# EasyEDA Pro project ProPrj_HEMY 2.0_2025-04-23.epro, schematic Schematic3_1
Board Name: DC & ETH_1; Create Date: 2025-03-09; Page Name: P1; Project Name: AstraNode; Schematic Name: Schematic3_1; Update Date: 2025-03-09; Company: EasyEDA.com; Page Size: A4; Version: V1.0
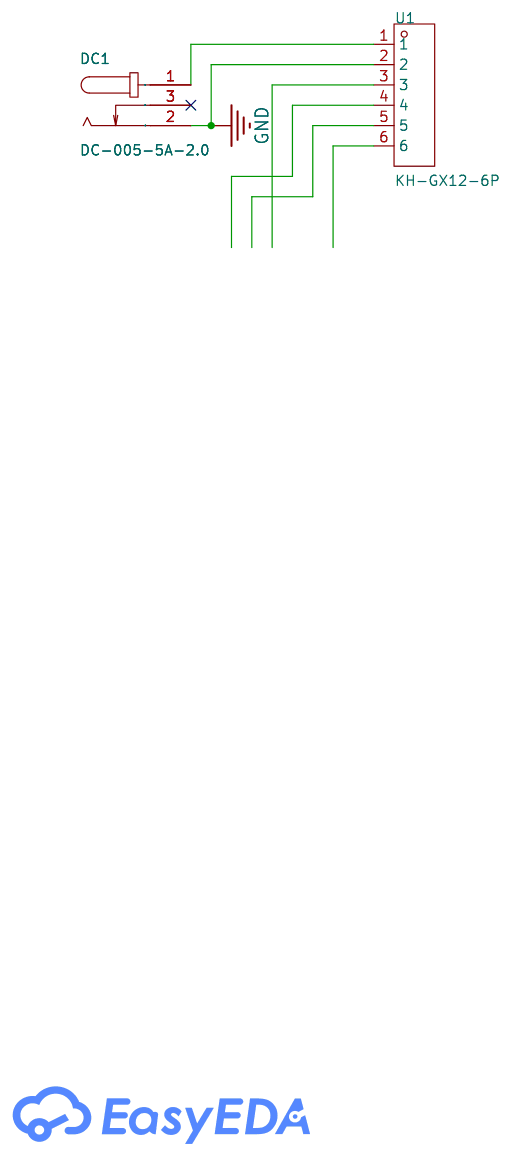
[diagram p5: schematic sheet]

## Parts
DC1  DC-005-5A-2.0  [DC-IN-TH_DC-005-5A-2.0]  (no BOM)
U1  KH-GX12-6P  [CONN-TH_GX12-6P]  (no BOM)

## Library data of the parts
DC1 = DC-005-5A-2.0: Connector Type:DC Power Receptacle Mounting Style:Bend insert Inside Contact Diameter:2mm Outside Contact Diameter:6.2mm Current Rating (Max):5A Voltage Rating (Max):24V Operating Temperature Range:-20℃~+70℃ Operating Temperature Range:-20℃~+70℃; LCSC Part Name: DC电源插座 内径:2mm 外径:6.2mm; Supplier Part: C381116; Manufacturer: XKB Connection(中国星坤); Supplier Footprint: 插件; JLCPCB Part Class: Extended Part; Datasheet: https://atta.szlcsc.com/upload/public/pdf/source/20211015/707A35F7AB6E89C57AAB641950105BB7.pdf; Supplier: LCSC; Connector Type: DC Power Receptacle; Mounting Style: Bend insert; Inside Contact Diameter: 2mm; Outside Contact Diameter: 6.2mm; Current Rating (Max): 5A; Voltage Rating (Max): 24V; Operating Temperature Range: -20℃~+70℃
U1 = KH-GX12-6P: Socket Specification:M12 Number of Pins:6P Gender:公母一套 Angle:直头 Coding Scheme:- Level of Protection:- Current Rating (Max):5A Rated Voltage (Max):125V Contact Material:- Contact Plating:- Operating Temperature Range:-20℃~+85℃ Operating Temperature Range:-; LCSC Part Name: 2件套; Supplier Part: C18203264; Manufacturer: kinghelm(金航标); JLCPCB Part Class: Extended Part; Datasheet: https://atta.szlcsc.com/upload/public/pdf/source/20230927/54C8C016C9BD795CB5C7B9261DE17A1E.pdf; Supplier: LCSC; Socket Specification: M12; Number of Pins: 6P; Gender: 公母一套; Angle: 直头; Current Rating (Max): 5A; Rated Voltage (Max): 125V; Operating Temperature Range: -20℃~+85℃

## Nets
GND: DC1.2 U1.2
$1N564: DC1.1 U1.1

Not connected (* = marked no-connect by the designer): DC1 3*; U1 3 4 5 6
